# Altium schematic sheet Resistor.SchDoc
size A; SheetNumber: 1; SheetTotal: 14
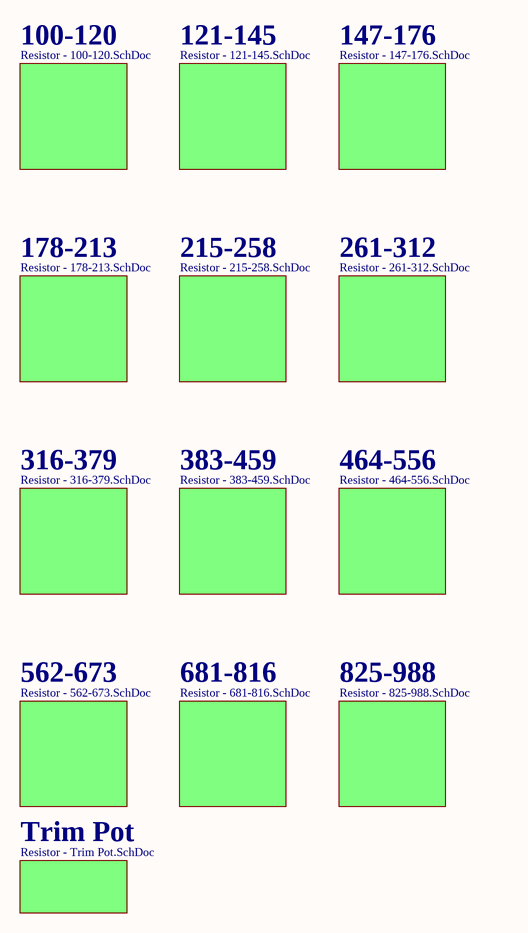
[diagram p0: Resistor.SchDoc]

## Sub-sheets
100-120 = Resistor - 100-120.SchDoc: no entries
121-145 = Resistor - 121-145.SchDoc: no entries
147-176 = Resistor - 147-176.SchDoc: no entries
178-213 = Resistor - 178-213.SchDoc: no entries
215-258 = Resistor - 215-258.SchDoc: no entries
261-312 = Resistor - 261-312.SchDoc: no entries
316-379 = Resistor - 316-379.SchDoc: no entries
383-459 = Resistor - 383-459.SchDoc: no entries
464-556 = Resistor - 464-556.SchDoc: no entries
562-673 = Resistor - 562-673.SchDoc: no entries
681-816 = Resistor - 681-816.SchDoc: no entries
825-988 = Resistor - 825-988.SchDoc: no entries
Trim Pot = Resistor - Trim Pot.SchDoc: no entries